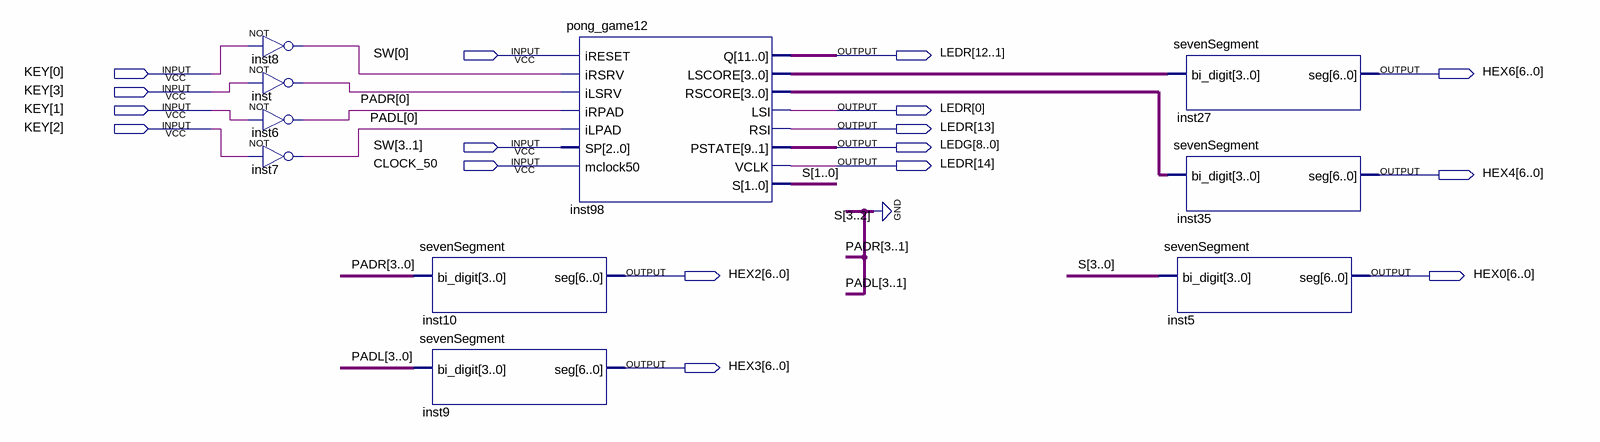
[diagram p0: schematic sheet]
// Quartus schematic Lab9.bdf as structural Verilog: 10 symbols, 17 pins
module Lab9 (
  input  [3:0] SW,
  input  [3:0] KEY,
  input  CLOCK_50,
  output [14:0] LEDR,
  output [6:0] HEX6,
  output [8:0] LEDG,
  output [6:0] HEX4,
  output [6:0] HEX2,
  output [6:0] HEX0,
  output [6:0] HEX3
);

  wire inst8_out, inst_out;
  wire [0:0] PADL;
  wire [3:0] inst98_lscore, inst98_rscore, PADR, S;

  not inst8 (inst8_out, KEY[0]);
  not inst (inst_out, KEY[3]);
  not inst6 (PADR[0], KEY[1]);
  not inst7 (PADL[0], KEY[2]);
  sevenSegment inst10 (.bi_digit(PADR), .seg(HEX2));
  sevenSegment inst9 (.bi_digit({3'b000, PADL[0]}), .seg(HEX3));
  pong_game12 inst98 (
    .iRESET(SW[0]), .iRSRV(inst8_out), .iLSRV(inst_out), .iRPAD(PADR[0]), .iLPAD(PADL[0]), .SP(SW[3:1]),
    .mclock50(CLOCK_50), .Q(LEDR[12:1]), .LSCORE(inst98_lscore), .RSCORE(inst98_rscore), .LSI(LEDR[0]),
    .RSI(LEDR[13]), .PSTATE(LEDG), .VCLK(LEDR[14]), .S(S[1:0]));
  sevenSegment inst27 (.bi_digit(inst98_lscore), .seg(HEX6));
  sevenSegment inst35 (.bi_digit(inst98_rscore), .seg(HEX4));
  sevenSegment inst5 (.bi_digit(S), .seg(HEX0));
endmodule
